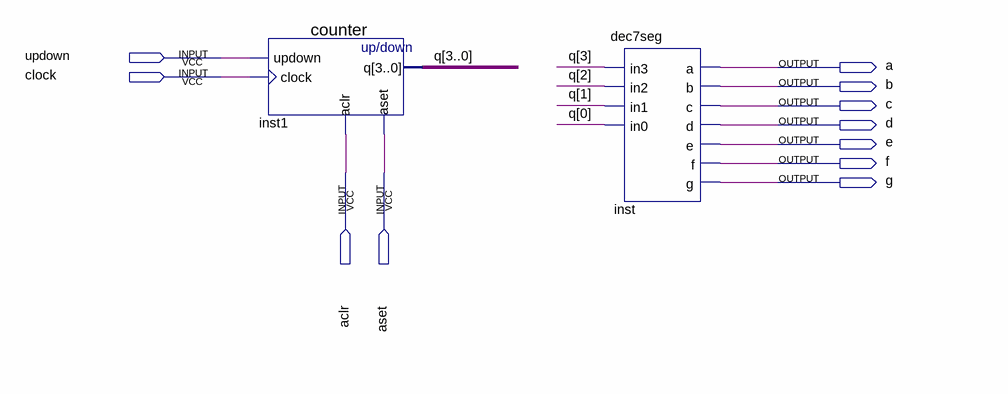
[diagram p0: schematic sheet]
// Quartus schematic counter7seg.bdf as structural Verilog: 2 symbols, 11 pins
module counter7seg (
  input  updown,
  input  clock,
  input  aclr,
  input  aset,
  output a,
  output b,
  output c,
  output d,
  output e,
  output f,
  output g
);

  wire [3:0] q;

  counter inst1 (.updown(updown), .clock(clock), .aclr(aclr), .aset(aset), .q(q));
  dec7seg inst (.in3(q[3]), .in2(q[2]), .in1(q[1]), .in0(q[0]), .a(a), .b(b), .c(c), .d(d), .e(e), .f(f), .g(g));
endmodule
